# Altium schematic sheet ethernet.SchDoc: Example Template
size A4; CompanyName: University of Manchester; Engineer: Sam Walsh; Organization: University of Manchester; Address1: L3, 12a Rodborough Rd; Address2: Frenchs Forest; Address3: NSW; Address4: Australia 2086; DocumentNumber: 1; Revision: 0; SheetNumber: 5; SheetTotal: 8; Scale: Ratio
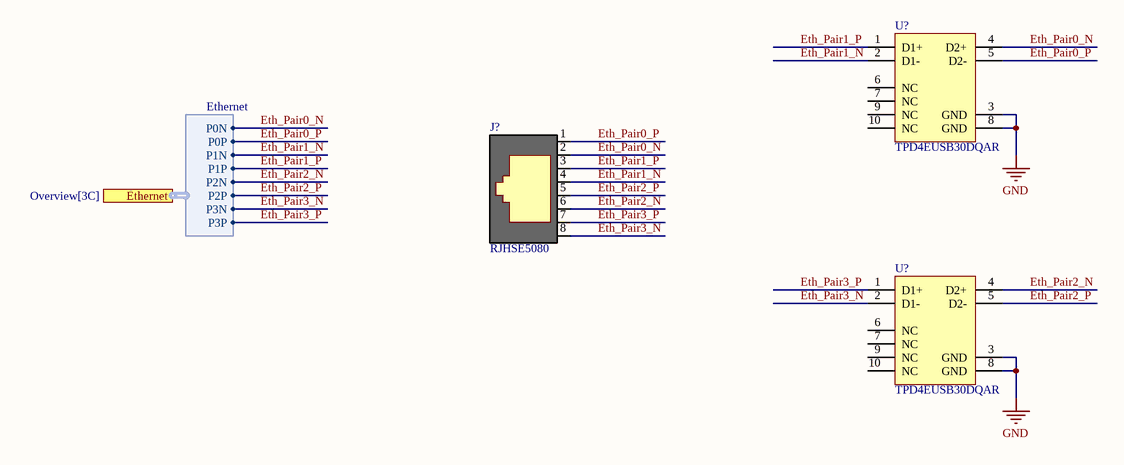
[diagram p0: ethernet.SchDoc]

## Parts
(Parts that share a designator on the sheet are numbered #1, #2 ... from top to bottom, then left to right.)
J?  RJHSE5080  [AMPHENOL_RJHSE-5080]
U?#1  TPD4EUSB30DQAR  [DQA0010A_V]
U?#2  TPD4EUSB30DQAR  [DQA0010A_V]

## Ports
Ethernet (harness Ethernet, see Overview[3C])

## Harnesses
Ethernet: P0N, P0P, P1N, P1P, P2N, P2P, P3N, P3P

## Nets
GND: U?#1.3(GND) U?#1.8(GND) U?#2.3(GND) U?#2.8(GND)
Eth_Pair0_N: J?.2(1-) U?#1.4(D2+) ; port Ethernet.P0N
Eth_Pair0_P: J?.1(1+) U?#1.5(D2-) ; port Ethernet.P0P
Eth_Pair1_N: J?.4(2-) U?#1.2(D1-) ; port Ethernet.P1N
Eth_Pair1_P: J?.3(2+) U?#1.1(D1+) ; port Ethernet.P1P
Eth_Pair2_N: J?.6(3-) U?#2.4(D2+) ; port Ethernet.P2N
Eth_Pair2_P: J?.5(3+) U?#2.5(D2-) ; port Ethernet.P2P
Eth_Pair3_N: J?.8(4-) U?#2.2(D1-) ; port Ethernet.P3N
Eth_Pair3_P: J?.7(4+) U?#2.1(D1+) ; port Ethernet.P3P

Not connected (* = marked no-connect by the designer): U?#1 6(NC) 7(NC) 9(NC) 10(NC); U?#2 6(NC) 7(NC) 9(NC) 10(NC)

## Notes on the sheet
- Size:
- Title
- A4
- Scale:
- NTS
- Revision:
- Designer
- Date:
- Sheet
- of

## Library data of the parts
J? = RJHSE-5080: CONN MOD JACK 8P8C R/A UNSHLD; Manufacturer: Amphenol; Contact Resistance: 20mR; Gender: Female; Number of Positions: 8; Max Current Rating: 1.5A; Pitch: 2.03mm; Voltage Rating (DC): 125V; Connector Type: RJ45; Manufacturer Part Number: RJHSE5080; Contact Plating: Gold; Orientation: Right Angle; Mounting Technology: Through Hole,Panel; Lead Free: Lead Free; RoHS Compliant: Yes; Depth: 14.99mm; Length: 15.75mm
U?#1 U?#2 = CMP-0326-00027-3: ESD Solution for Super-Speed (6 GBPS) USB 3.0 Interface, 4 Channels, -40 to +85 degC, 10-pin SON (DQA), Green (RoHS & no Sb/Br); Manufacturer: Texas Instruments; Differential Capacitance(pF): 0.05; Serial ATA / eSATA: TRUE; IO Capacitance(Typ)(pF): 0.8; IO Leakage Current(nA): 10; IEC 61000-4-2 Air-Gap(+/- kV): 8; ComponentLink3Description: URL Link1; PartNumber: TPD4EUSB30DQAR; DatasheetVersion: SLVSAC2C; ComponentLink2URL: http://www.ti.com/general/docs/lit/getliterature.tsp?genericPartNumber=TPD4EUSB30&fileType=pdf; USB Super Speed: TRUE; Eco-Plan: Green (RoHS & no Sb/Br); Mounting Technology: Surface Mount; 1394 / Firewire: TRUE; PackageVersion: revB, Sep-2009; SubFamily: ESD Solution; USB Full Speed: TRUE; USB High Speed: TRUE; ComponentLink2Description: Datasheet; ComponentLink1URL: http://www.ti.com/; IEC 61000-4-2 Contact(+/- kV): 8; Breakdown Voltage(Min)(V): 8; PackageReference: DQA0010A; ComponentLink1Description: Manufacturer URL; PackageDescription: 10-Pin Plastic Small Outline No-Lead, 1 x 2.5 x 0.55 mm Body, 0.5 mm Pitch; ComponentLink3URL: SamplesURL:http://www.ti.com/product/tpd4eusb30#samples; HDMI: TRUE